# Altium schematic sheet MIC&Headphone.SchDoc: MIC&Headphone
size A4
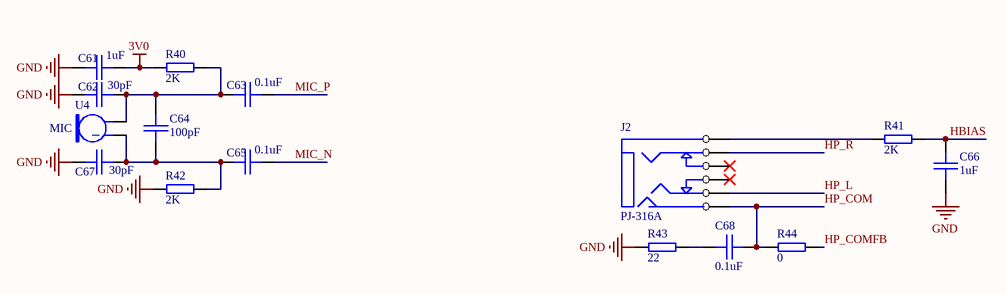
[diagram p0: MIC&Headphone.SchDoc]

## Parts
C61  1uF  [CAP-0603]
C62  30pF  [CAP-0603]
C63  0.1uF  [CAP-0603]
C64  100pF  [CAP-0603]
C65  0.1uF  [CAP-0603]
C66  1uF  [CAP-0603]
C67  30pF  [CAP-0603]
C68  0.1uF  [CAP-0603]
J2  PJ-316A  [PJ-316A]
R40  2K  [RES-0603]
R41  2K  [RES-0603]
R42  2K  [RES-0603]
R43  22  [RES-0603]
R44  0  [RES-0603]
U4  MIC  [MIC_9767]

## Nets
3V0: C61.2 R40.1
GND: C61.1 C62.1 C66.1 C67.1 R42.1 R43.1
HBIAS: C66.2 R41.2
HP_COM: C68.2 J2.4(MIC) R44.1
HP_COMFB: R44.2
HP_L: J2.2(L)
HP_R: J2.3(R)
MIC_N: C65.2
MIC_P: C63.2
NetC62_2: C62.2 C63.1 C64.2 R40.2 U4.2
NetC64_1: C64.1 C65.1 C67.2 R42.2 U4.1
NetC68_1: C68.1 R43.2
NetJ2_1: J2.1(GND) R41.1

Not connected (* = marked no-connect by the designer): J2 5(L_DET)* 6(R_DET)*

## Notes on the sheet
- Title
- Size:
- Date:
- A4
- Number:
- Time:
- Revision:
- Sheet
- of
- File:

## Library data of the parts
C61-C68 = C_0603: 陶瓷贴片电容0603; tolerance: 10%; voltage: 50V; ESR: 1.73mOhm; IRMS: 5.59A; Series: X7R
  C61 C66: C_value: 1uF
  C62 C67: C_value: 30pF
  C63 C65 C68: C_value: 0.1uF
  C64: C_value: 100pF
J2 = PJ-316A: 音频接口，左右声道+麦克
R40-R44 = R_0603: 贴片电阻0603; tolerance: 5%; voltage: 50V; power: 0.063W
  R40-R42: R_value: 2K
  R43: R_value: 22
  R44: R_value: 0
U4 = MIC: 咪头